# Altium schematic sheet CON_EXT_SPK.SchDoc: External Speaker Connectors
size A4; DocumentNumber: 6; SheetNumber: 7; SheetTotal: 77
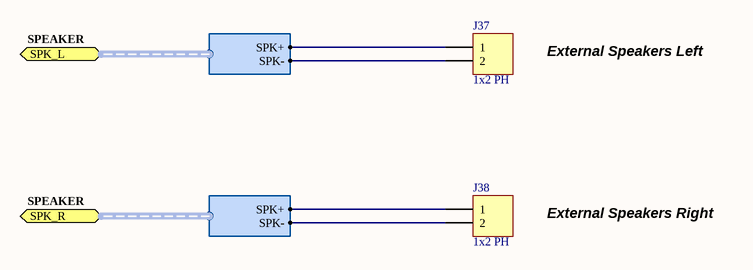
[diagram p0: CON_EXT_SPK.SchDoc]

## Parts
J37  1x2 PH  [PH-2]
J38  1x2 PH  [PH-2]

## Ports
SPK_L (harness SPEAKER), SPK_R (harness SPEAKER)

## Harnesses
SPEAKER: SPK-, SPK+

## Nets
NetJ37_1: J37.1 ; port SPK_L.SPK+
NetJ37_2: J37.2 ; port SPK_L.SPK-
NetJ38_1: J38.1 ; port SPK_R.SPK+
NetJ38_2: J38.2 ; port SPK_R.SPK-

## Notes on the sheet
- External Speakers Left
- External Speakers Right
- Sheet Title
- Project Title
- Size:
- Date:
- A4
- Assy:
- Time:
- Revision:
- Sheet
- of
- File:

## Library data of the parts
J37 J38 = D-300-0131: PH Series 2 x 1 Pin Vertical 2.0mm Pitch (Male); Connector type: Header; Max Current: 2A; Category: Connector; Status: Production; Mounting Technology: Through-Hole; Pin Count: 2